# Altium schematic sheet infopage.SchDoc: TemperatureTransducer
size A3; Author: wq; DrawnBy: wq; Organization: 合肥弗雷电子; Address1: 玉兰大道14号D栋3楼; Address2: 肥西县桃花镇; Address3: 合肥市; Address4: 安徽省; DocumentNumber: 1; Revision: betaV1.0; SheetNumber: 1; SheetTotal: 1
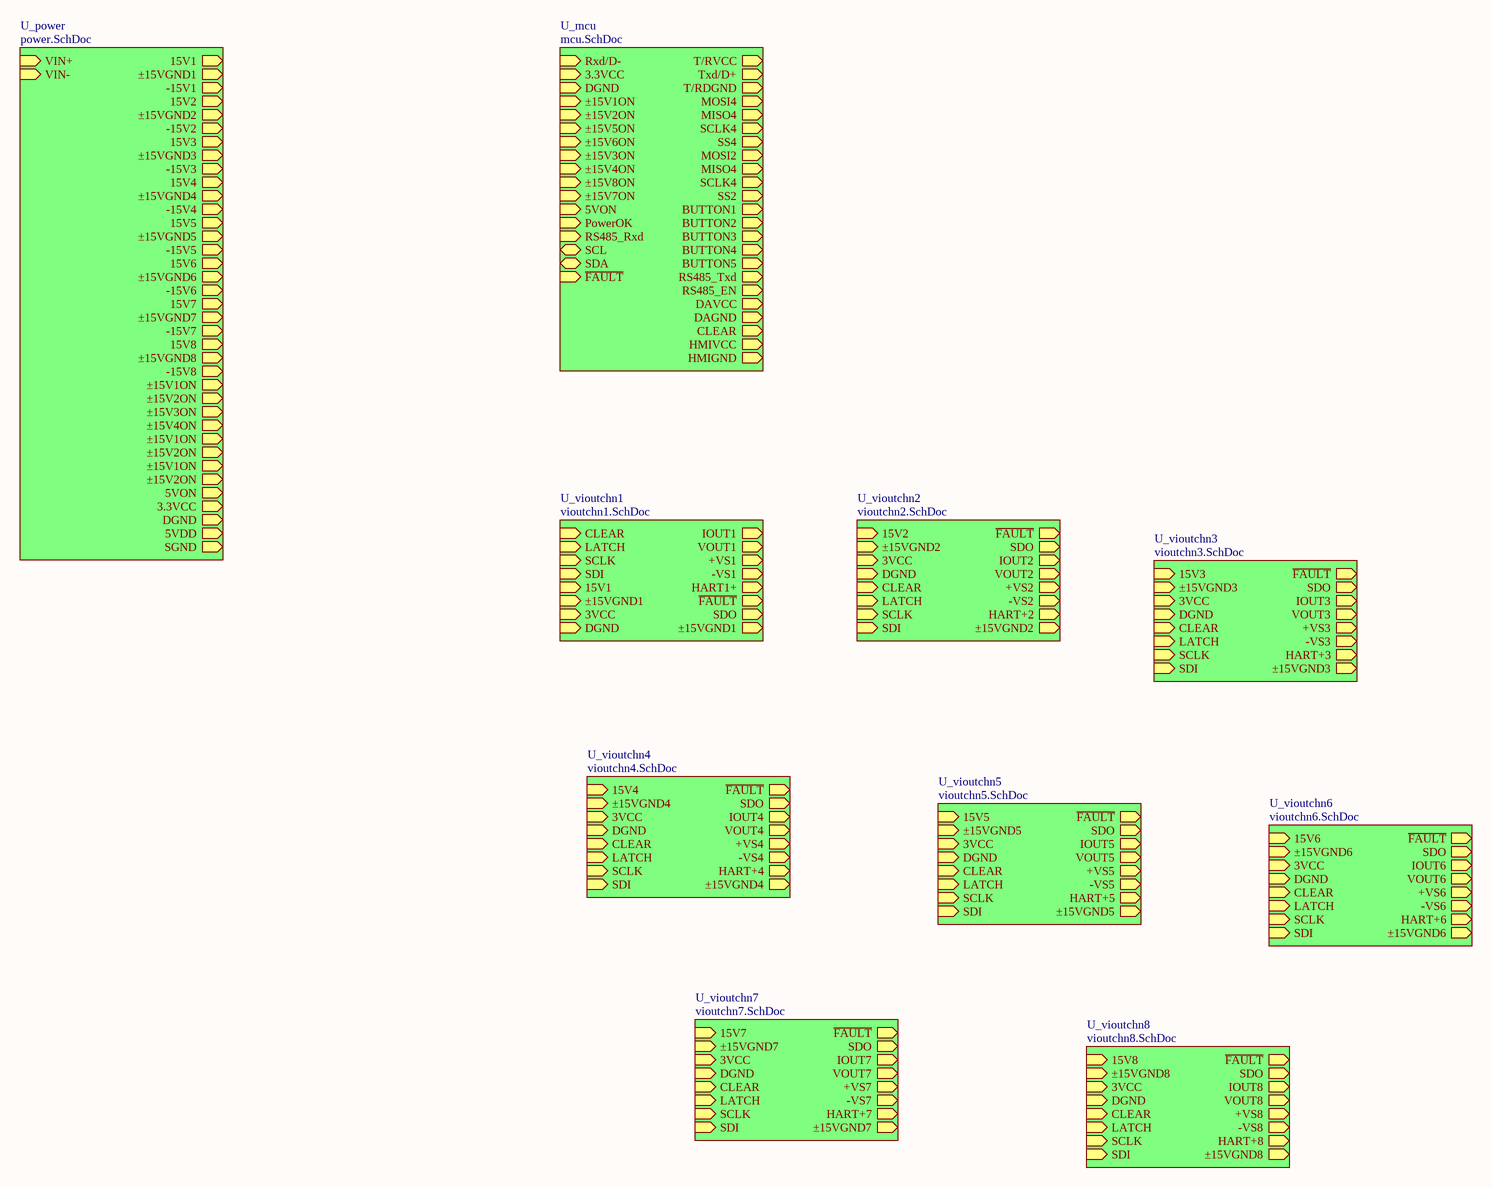
[diagram p0: infopage.SchDoc]

## Sub-sheets
U_mcu = mcu.SchDoc: T/RVCC (out), Txd/D+ (out), Rxd/D- (in), T/RDGND (out), 3.3VCC (in), DGND (in), MOSI4 (out), MISO4 (out), SCLK4 (out), SS4 (out), ±15V1ON (in), ±15V2ON (in), ±15V5ON (in), ±15V6ON (in), ±15V3ON (in), ±15V4ON (in), ±15V8ON (in), ±15V7ON (in), 5VON (in), PowerOK (in), MOSI2 (out), MISO4 (out), SCLK4 (out), SS2 (out), BUTTON1 (out), BUTTON2 (out), BUTTON3 (out), BUTTON4 (out), BUTTON5 (out), RS485_Txd (out), RS485_Rxd (in), RS485_EN (out), SCL (bidir), SDA (bidir), DAVCC (out), DAGND (out), CLEAR (out), ~{FAULT} (in), HMIVCC (out), HMIGND (out)
U_power = power.SchDoc: 15V1 (out), ±15VGND1 (out), -15V1 (out), 15V2 (out), ±15VGND2 (out), -15V2 (out), 15V3 (out), ±15VGND3 (out), -15V3 (out), 15V4 (out), ±15VGND4 (out), -15V4 (out), 15V5 (out), ±15VGND5 (out), -15V5 (out), 15V6 (out), ±15VGND6 (out), -15V6 (out), 15V7 (out), ±15VGND7 (out), -15V7 (out), 15V8 (out), ±15VGND8 (out), -15V8 (out), ±15V1ON (out), ±15V2ON (out), ±15V3ON (out), ±15V4ON (out), ±15V1ON (out), ±15V2ON (out), ±15V1ON (out), ±15V2ON (out), 5VON (out), VIN+ (in), VIN- (in), 3.3VCC (out), DGND (out), 5VDD (out), SGND (out)
U_vioutchn1 = vioutchn1.SchDoc: IOUT1 (out), VOUT1 (out), +VS1 (out), -VS1 (out), HART1+ (out), CLEAR (in), LATCH (in), SCLK (in), SDI (in), 15V1 (in), ±15VGND1 (in), 3VCC (in), DGND (in), ~{FAULT} (out), SDO (out), ±15VGND1 (out)
U_vioutchn2 = vioutchn2.SchDoc: 15V2 (in), ±15VGND2 (in), 3VCC (in), DGND (in), CLEAR (in), LATCH (in), SCLK (in), SDI (in), ~{FAULT} (out), SDO (out), IOUT2 (out), VOUT2 (out), +VS2 (out), -VS2 (out), HART+2 (out), ±15VGND2 (out)
U_vioutchn3 = vioutchn3.SchDoc: 15V3 (in), ±15VGND3 (in), 3VCC (in), DGND (in), CLEAR (in), LATCH (in), SCLK (in), SDI (in), ~{FAULT} (out), SDO (out), IOUT3 (out), VOUT3 (out), +VS3 (out), -VS3 (out), HART+3 (out), ±15VGND3 (out)
U_vioutchn4 = vioutchn4.SchDoc: 15V4 (in), ±15VGND4 (in), 3VCC (in), DGND (in), CLEAR (in), LATCH (in), SCLK (in), SDI (in), ~{FAULT} (out), SDO (out), IOUT4 (out), VOUT4 (out), +VS4 (out), -VS4 (out), HART+4 (out), ±15VGND4 (out)
U_vioutchn5 = vioutchn5.SchDoc: 15V5 (in), ±15VGND5 (in), 3VCC (in), DGND (in), CLEAR (in), LATCH (in), SCLK (in), SDI (in), ~{FAULT} (out), SDO (out), IOUT5 (out), VOUT5 (out), +VS5 (out), -VS5 (out), HART+5 (out), ±15VGND5 (out)
U_vioutchn6 = vioutchn6.SchDoc: 15V6 (in), ±15VGND6 (in), 3VCC (in), DGND (in), CLEAR (in), LATCH (in), SCLK (in), SDI (in), ~{FAULT} (out), SDO (out), IOUT6 (out), VOUT6 (out), +VS6 (out), -VS6 (out), HART+6 (out), ±15VGND6 (out)
U_vioutchn7 = vioutchn7.SchDoc: 15V7 (in), ±15VGND7 (in), 3VCC (in), DGND (in), CLEAR (in), LATCH (in), SCLK (in), SDI (in), ~{FAULT} (out), SDO (out), IOUT7 (out), VOUT7 (out), +VS7 (out), -VS7 (out), HART+7 (out), ±15VGND7 (out)
U_vioutchn8 = vioutchn8.SchDoc: 15V8 (in), ±15VGND8 (in), 3VCC (in), DGND (in), CLEAR (in), LATCH (in), SCLK (in), SDI (in), ~{FAULT} (out), SDO (out), IOUT8 (out), VOUT8 (out), +VS8 (out), -VS8 (out), HART+8 (out), ±15VGND8 (out)

## Notes on the sheet
- Title
- Size:
- Date:
- A3
- Number:
- Time:
- Revision:
- Sheet
- of
- File: